# Altium schematic sheet dd_current_sense.SchDoc
size A4; SheetNumber: 1; SheetTotal: 1
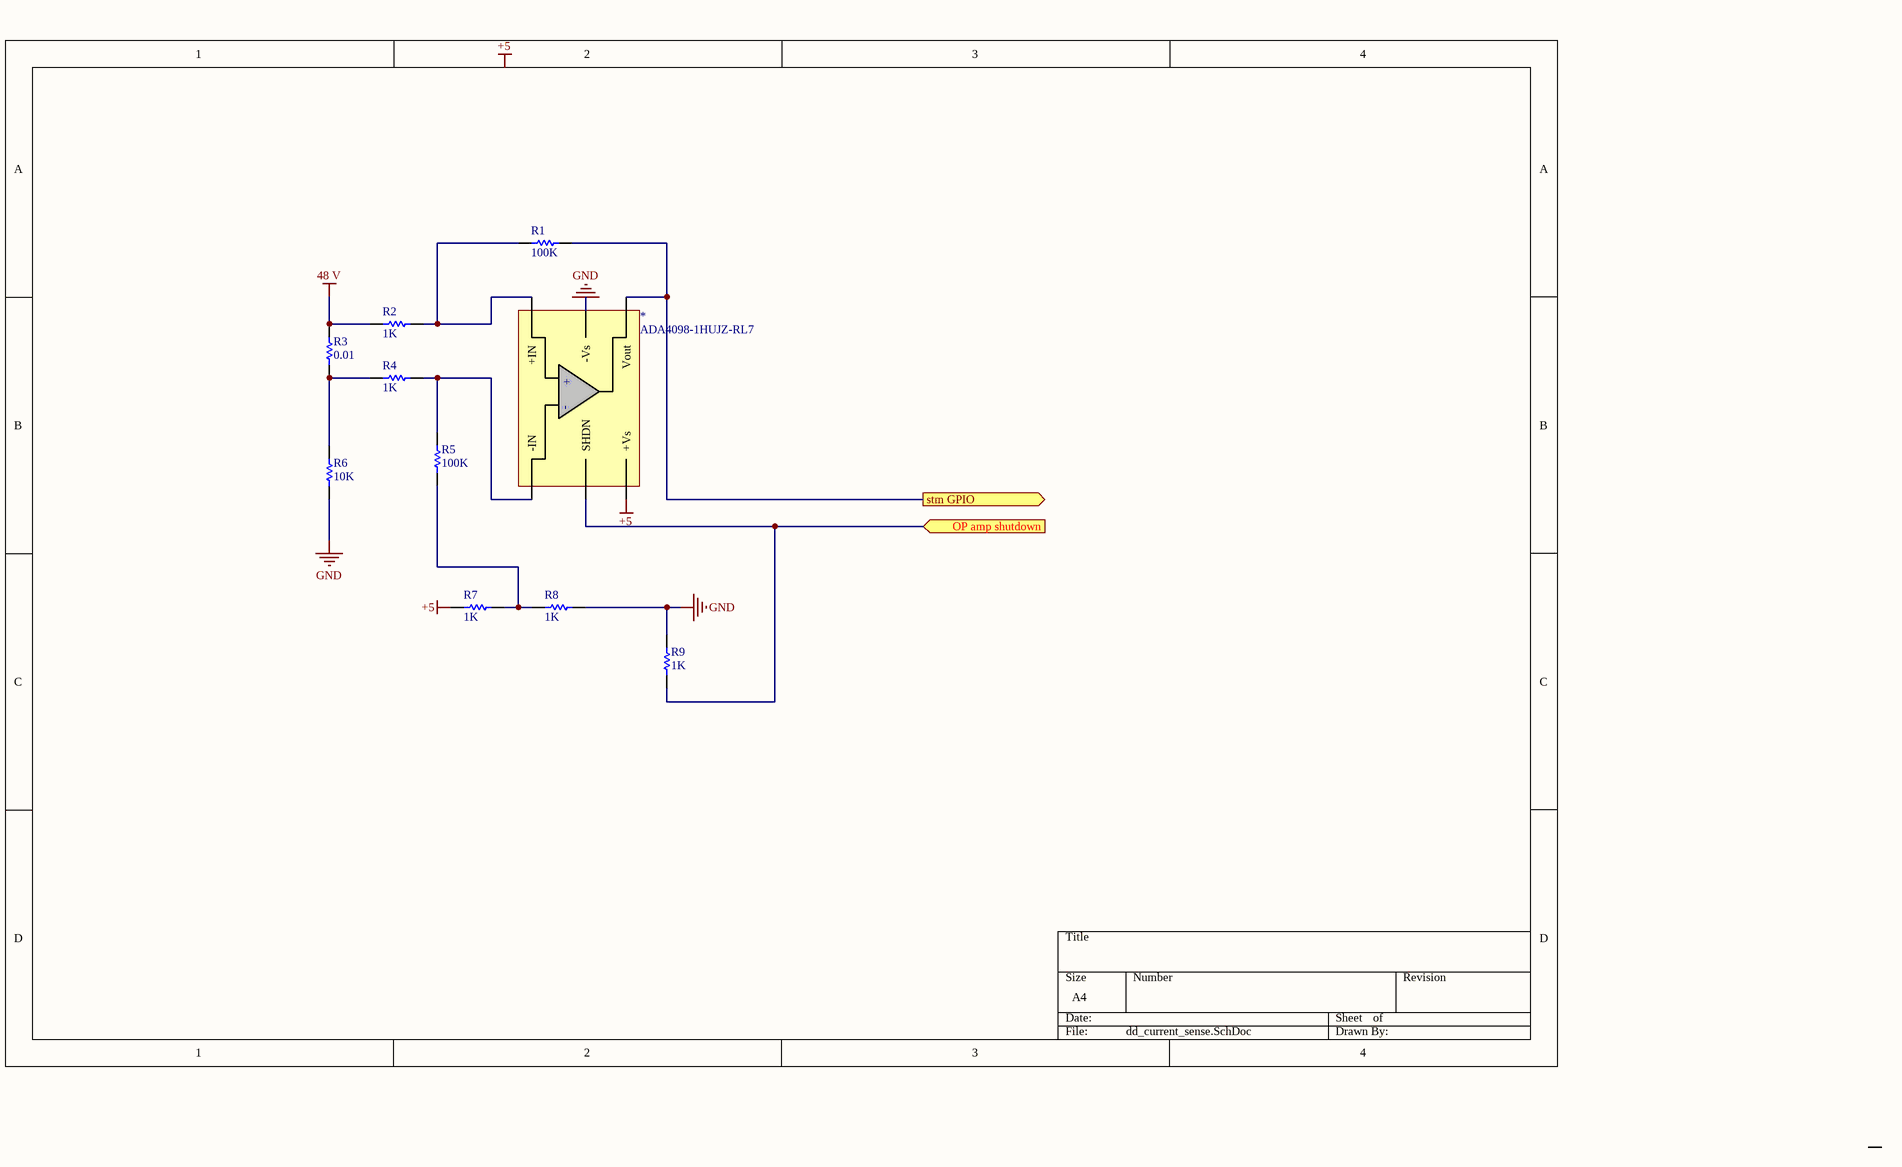
[diagram p0: dd_current_sense.SchDoc]

## Parts
*  ADA4098-1HUJZ-RL7
R1  value 100K  (hidden comment: Resistor)
R2  value 1K  (hidden comment: Resistor)
R3  value 0.01  (hidden comment: Resistor)
R4  value 1K  (hidden comment: Resistor)
R5  value 100K  (hidden comment: Resistor)
R6  value 10K  (hidden comment: Resistor)
R7  value 1K  (hidden comment: Resistor)
R8  value 1K  (hidden comment: Resistor)
R9  value 1K  (hidden comment: Resistor)

## Ports
OP amp shutdown (in), stm GPIO (out)

## Nets
48 V: R2.1 R3.2
+5: *.45(+Vs) R7.1
GND: *.41(-Vs) R6.1 R8.2 R9.1
OP amp shutdown: *.44(SHDN) R9.2 ; port OP amp shutdown
stm GPIO: *.40(Vout) R1.2 ; port stm GPIO
Net*_42: *.42(+IN) R1.1 R2.2
Net*_43: *.43(-IN) R4.2 R5.1
NetR3_1: R3.1 R4.1 R6.2
NetR5_2: R5.2 R7.2 R8.1

## Notes on the sheet
- Labels drawn without touching a wire or pin: +5
- (in symbol ADA4098-1HUJZ-RL7) +; -

## Library data of the parts
* = ADA4098-1HUJZ-RL7: The ADA4098-1 is a robust, precision, rail-to-rail input and output operational amplifier (op amp) with inputs that...; Manufacturer: Analog Devices; Supplier 1: Arrow Electronics; Manufacturer Part Number: ADA4098-1HUJZ-RL7; RoHS: Yes; Category: Amplifiers - Op Amps, Buffer, Instrumentation; Stock 1: 2096; Pricing 1: 1=10.65940, 10=9.61630, 25=9.15170, 50=8.18570, 100=7.84070, 250=7.24620, 500=6.85290, 1000=6.78500 (USD); Supplier Part Number 1: ADA4098-1HUJZ-RL7
R1-R9 = Resistor: TC1: 0; SimulationGenericComponent: True; TC2: 0